# Altium schematic sheet Public CPU RGMII.schdoc
size 90 x 209 mm
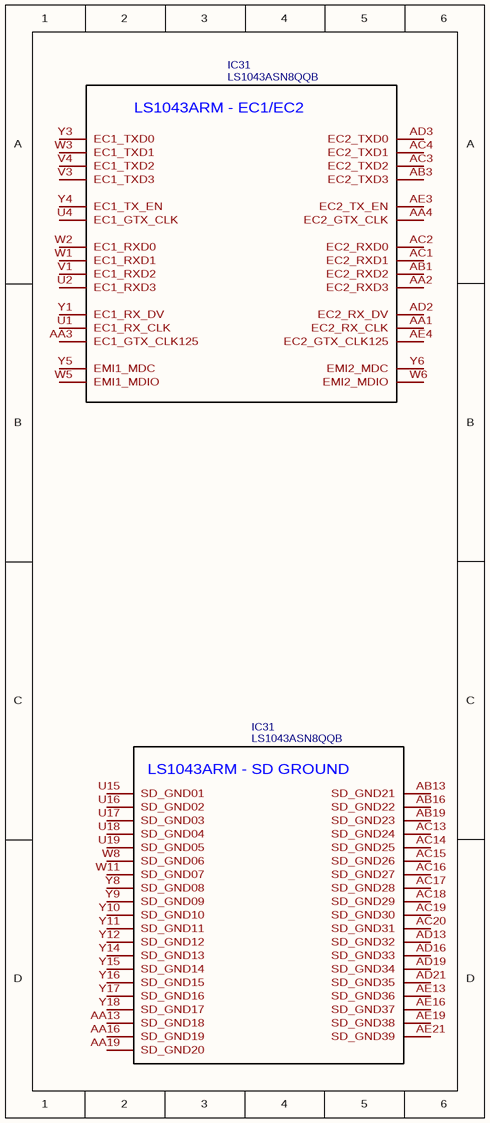
[diagram p0: Public CPU RGMII.schdoc]

## Parts
(Parts that share a designator on the sheet are numbered #1, #2 ... from top to bottom, then left to right.)
IC31#1  LS1043ASN8QQB  [BGA621C65P25X25_1700X1700X218N]
IC31#2  LS1043ASN8QQB  [BGA621C65P25X25_1700X1700X218N]

## Nets

Not connected (* = marked no-connect by the designer): IC31#1 AA1(EC2_RX_CLK) AA2(EC2_RXD3) AA3(EC1_GTX_CLK125) AA4(EC2_GTX_CLK) AB1(EC2_RXD2) AB3(EC2_TXD3) AC1(EC2_RXD1) AC2(EC2_RXD0) AC3(EC2_TXD2) AC4(EC2_TXD1) AD2(EC2_RX_DV) AD3(EC2_TXD0) AE3(EC2_TX_EN) AE4(EC2_GTX_CLK125) U1(EC1_RX_CLK) U2(EC1_RXD3) U4(EC1_GTX_CLK) V1(EC1_RXD2) V3(EC1_TXD3) V4(EC1_TXD2) W1(EC1_RXD1) W2(EC1_RXD0) W3(EC1_TXD1) W5(EMI1_MDIO) W6(EMI2_MDIO) Y1(EC1_RX_DV) Y3(EC1_TXD0) Y4(EC1_TX_EN) Y5(EMI1_MDC) Y6(EMI2_MDC); IC31#2 AA13(SD_GND18) AA16(SD_GND19) AA19(SD_GND20) AB13(SD_GND21) AB16(SD_GND22) AB19(SD_GND23) AC13(SD_GND24) AC14(SD_GND25) AC15(SD_GND26) AC16(SD_GND27) AC17(SD_GND28) AC18(SD_GND29) AC19(SD_GND30) AC20(SD_GND31) AD13(SD_GND32) AD16(SD_GND33) AD19(SD_GND34) AD21(SD_GND35) AE13(SD_GND36) AE16(SD_GND37) AE19(SD_GND38) AE21(SD_GND39) U15(SD_GND01) U16(SD_GND02) U17(SD_GND03) U18(SD_GND04) U19(SD_GND05) W8(SD_GND06) W11(SD_GND07) Y8(SD_GND08) Y9(SD_GND09) Y10(SD_GND10) Y11(SD_GND11) Y12(SD_GND12) Y14(SD_GND13) Y15(SD_GND14) Y16(SD_GND15) Y17(SD_GND16) Y18(SD_GND17)

## Notes on the sheet
- (in symbol LS1043ASN8QQB) LS1043ARM - EC1/EC2; LS1043ARM - SD GROUND

## Library data of the parts
IC31#1 IC31#2 = LS1043ASN8QQB: subpart_no: 1; Contributor: Ke'Ondrae_Mell; spicePre: I; spiceSymbolName: LS1043ASN8QQB